# Altium schematic sheet SIM808.SchDoc
size A4
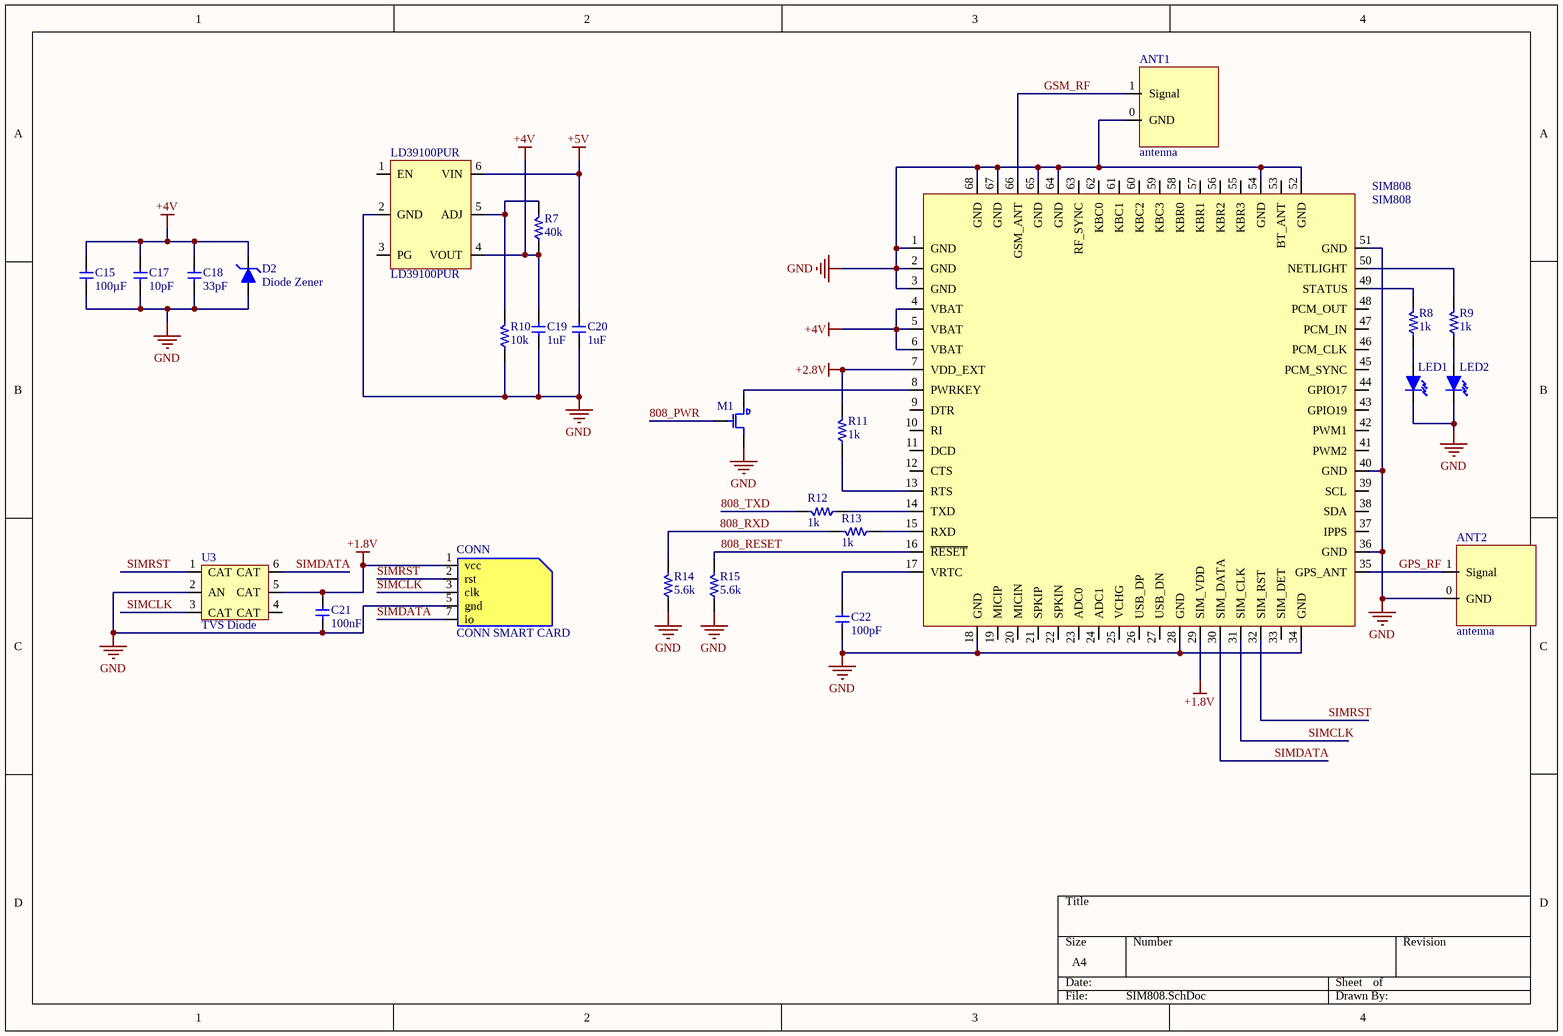
[diagram p0: SIM808.SchDoc]

## Parts
ANT1  antenna  [uFL]
ANT2  antenna  [uFL]
C15  Capacitance: 100µF  [Cap 1210]  (hidden comment: Cap Cer 100uF)
C17  value 10pF  [0805]  (hidden comment: Generic Capacitor)
C18  value 33pF  [0805]  (hidden comment: Generic Capacitor)
C19  value 1uF  [0805]  (hidden comment: Generic Capacitor)
C20  value 1uF  [0805]  (hidden comment: Generic Capacitor)
C21  value 100nF  [0805]  (hidden comment: Generic Capacitor)
C22  value 100pF  [0805]  (hidden comment: Generic Capacitor)
CONN  CONN SMART CARD  [CONN SMART CARD]
D2  Diode Zener  [Diode Zener]
LD39100PUR  LD39100PUR  [LD39100PUR]
LED1  Led Red  [0805 LED]  (value not drawn)
LED2  Led Green  [0805 LED]  (value not drawn)
M1  N-CH Mosfet Switch  [SOT32-3]  (value not drawn)
R7  value 40k  [0805]  (hidden comment: Resistor)
R8  value 1k  [0805]  (hidden comment: Resistor)
R9  value 1k  [0805]  (hidden comment: Resistor)
R10  value 10k  [0805]  (hidden comment: Resistor)
R11  value 1k  [0805]  (hidden comment: Resistor)
R12  value 1k  [0805]  (hidden comment: Resistor)
R13  value 1k  [0805]  (hidden comment: Resistor)
R14  value 5.6k  [0805]  (hidden comment: Resistor)
R15  value 5.6k  [0805]  (hidden comment: Resistor)
SIM808  SIM808  [SIM808]
U3  TVS Diode  [SMF05CT2G]

## Nets
+1.8V: C21.1 CONN.1(vcc) SIM808.29(SIM_VDD) U3.5(CAT)
+2.8V: R11.2 SIM808.7(VDD_EXT)
+4V: C15.1 C17.1 C18.1 C19.2 D2.1 LD39100PUR.4(VOUT) R7.1 SIM808.4(VBAT) SIM808.5(VBAT) SIM808.6(VBAT)
+5V: C20.1 LD39100PUR.6(VIN)
GND: ANT1.0(GND) ANT2.0(GND) C15.2 C17.2 C18.2 C19.1 C20.2 C21.2 C22.2 CONN.5(gnd) D2.2 LD39100PUR.2(GND) LED1.1 LED2.1 M1.2(S) R10.1 R14.1 R15.1 SIM808.1(GND) SIM808.2(GND) SIM808.3(GND) SIM808.18(GND) SIM808.28(GND) SIM808.34(GND) SIM808.36(GND) SIM808.40(GND) SIM808.51(GND) SIM808.52(GND) SIM808.54(GND) SIM808.64(GND) SIM808.65(GND) SIM808.67(GND) SIM808.68(GND) U3.2(AN)
808_PWR: M1.1(G)
808_RESET: R15.2 SIM808.16(~{RESET})
808_RXD: R13.2 R14.2
808_TXD: R12.2
GPS_RF: ANT2.1(Signal) SIM808.35(GPS_ANT)
GSM_RF: ANT1.1(Signal) SIM808.66(GSM_ANT)
SIMCLK: CONN.3(clk) SIM808.31(SIM_CLK) U3.3(CAT)
SIMDATA: CONN.7(io) SIM808.30(SIM_DATA) U3.6(CAT)
SIMRST: CONN.2(rst) SIM808.32(SIM_RST) U3.1(CAT)
NetC22_1: C22.1 SIM808.17(VRTC)
NetLD39100PUR_5: LD39100PUR.5(ADJ) R7.2 R10.2
NetLED1_2: LED1.2 R8.1
NetLED2_2: LED2.2 R9.1
NetM1_3: M1.3(D) SIM808.8(PWRKEY)
NetR8_2: R8.2 SIM808.49(STATUS)
NetR9_2: R9.2 SIM808.50(NETLIGHT)
NetR11_1: R11.1 SIM808.13(RTS)
NetR12_1: R12.1 SIM808.14(TXD)
NetR13_1: R13.1 SIM808.15(RXD)

Not connected (* = marked no-connect by the designer): LD39100PUR 1(EN) 3(PG); SIM808 9(DTR) 10(RI) 11(DCD) 12(CTS) 19(MICIP) 20(MICIN) 21(SPKIP) 22(SPKIN) 23(ADC0) 24(ADC1) 25(VCHG) 26(USB_DP) 27(USB_DN) 33(SIM_DET) 37(IPPS) 38(SDA) 39(SCL) 41(PWM2) 42(PWM1) 43(GPIO19) 44(GPIO17) 45(PCM_SYNC) 46(PCM_CLK) 47(PCM_IN) 48(PCM_OUT) 53(BT_ANT) 55(KBR3) 56(KBR2) 57(KBR1) 58(KBR0) 59(KBC3) 60(KBC2) 61(KBC1) 62(KBC0) 63(RF_SYNC); U3 4(CAT)

## Library data of the parts
ANT1 ANT2 = antenna: uFL SMT Antenna Connector; mfr: adafruit; supplier: https://www.adafruit.com/product/1661
C15 = LMK325ABJ107MM-P: CAP CER 100UF 10V X5R 1210; Manufacturer: Taiyo Yuden; Tolerance: ±20%; Supplier 1: Digi-Key; Manufacturer Part Number: LMK325ABJ107MM-P; Pricing 1: 1=1.55, 10=1.231, 25=1.1284, 50=1.0668, 100=0.9231, 250=0.82052, 500=0.69746 (CAD); Packaging: Cut Tape (CT); Part Status: Active; Voltage - Rated: 10V; Temperature Coefficient: X5R; Operating Temperature: -55°C ~ 85°C; Features: -; Ratings: -; Applications: General Purpose; Mounting Type: Surface Mount, MLCC; Package / Case: 1210 (3225 Metric); Size / Dimension: 0.126" L x 0.098" W (3.20mm x 2.50mm); Height - Seated (Max): -; Thickness (Max): 0.110" (2.80mm); Lead Spacing: -; Lead Style: -; ComponentLink1URL: http://ds.yuden.co.jp/TYCOMPAS/ut/detail.do?productNo=LMK325ABJ107MM-P&fileName=LMK325ABJ107MM-P_SS&mode=specSheetDownload; ComponentLink1Description: http://ds.yuden.co.jp/TYCOMPAS/ut/detail.do?productNo=LMK325ABJ107MM-P&fileName=LMK325ABJ107MM-P_SS&mode=specSheetDownload; Supplier Part Number 1: 587-4317-1-ND
C17-C22 = Capacitor
CONN = CONN SMART CARD: Manufacturer: Wurth Electronics Inc; Manufacturer Part Number: 693022010811; Card Type: Micro SIM; Number of Positions: 8; Connector Type: Connector and Ejector; Insertion, Removal Method: Hinged Lid; Supplier 1: Digi-Key; Pricing 1: 1=2.6, 10=2.384, 50=2.2076, 100=2.0317, 500=1.76614 (CAD); Packaging: Cut Tape (CT); Part Status: Active; Ejector Side: -; Mounting Type: Surface Mount, Right Angle; Features: Shielded; Height Above Board: 0.077" (1.95mm); Mounting Feature: Normal, Standard - Top; Contact Finish: Gold; Contact Finish Thickness: -; ComponentLink1URL: http://katalog.we-online.de/em/datasheet/693022010811.pdf; ComponentLink1Description: http://katalog.we-online.de/em/datasheet/693022010811.pdf; Supplier Part Number 1: 732-5957-1-ND
D2 = MMSZ5231BT1G: DIODE ZENER 5.1V 500MW SOD123; Manufacturer: ON Semiconductor; Tolerance: ±5%; Impedance (Max) (Zzt): 17 Ohm; Current - Reverse Leakage @ Vr: 5µA @ 2V; Voltage - Forward (Vf) (Max) @ If: 900mV @ 10mA; Supplier 1: Digi-Key; Manufacturer Part Number: MMSZ5231BT1G; Pricing 1: 1=0.34, 10=0.282, 100=0.149, 500=0.09802, 1000=0.06666 (CAD); Packaging: Cut Tape (CT); Part Status: Active; Voltage - Zener (Nom) (Vz): 5.1V; Power - Max: 500mW; Operating Temperature: -55°C ~ 150°C; Mounting Type: Surface Mount; Package / Case: SOD-123; Supplier Device Package: SOD-123; ComponentLink1URL: http://www.onsemi.com/pub_link/Collateral/MMSZ5221BT1-D.PDF; ComponentLink1Description: http://www.onsemi.com/pub_link/Collateral/MMSZ5221BT1-D.PDF; Supplier Part Number 1: MMSZ5231BT1GOSCT-ND
LD39100PUR = LD39100PUR: Adjustable linear voltage regulator; mfr: ST; supplier: http://www.digikey.ca/product-detail/en/stmicroelectronics/LD39100PUR/497-11013-1-ND/2524221
LED1 = LTST-C171EKT: LED RED CLEAR 0805 SMD; Manufacturer: Lite-On Inc.; Lens Color: Colorless; Millicandela Rating: 6mcd; Lens Style/Size: Rectangle with Flat Top, 1.40mm x 1.25mm; Voltage - Forward (Vf) (Typ): 2V; Current - Test: 20mA; Viewing Angle: 130°; Wavelength - Dominant: 621nm; Wavelength - Peak: 630nm; Supplier 1: Digi-Key; Manufacturer Part Number: LTST-C171EKT; Pricing 1: 1=0.48, 10=0.351, 25=0.2588, 100=0.1848, 250=0.12564, 500=0.11086, 1000=0.08684 (CAD); Packaging: Cut Tape (CT); Part Status: Active; Color: Red; Lens Transparency: Clear; Mounting Type: Surface Mount; Features: -; Package / Case: 0805 (2012 Metric); Supplier Device Package: Chip LED; Size / Dimension: 2.00mm L x 1.25mm W; Height (Max): 0.80mm; ComponentLink1URL: http://media.digikey.com/pdf/Data%20Sheets/Lite-On%20PDFs/LTST-C171EKT.pdf; ComponentLink1Description: http://media.digikey.com/pdf/Data%20Sheets/Lite-On%20PDFs/LTST-C171EKT.pdf; Supplier Part Number 1: 160-1422-1-ND
LED2 = LTST-C170GKT: LED GREEN CLEAR 0805 SMD; Manufacturer: Lite-On Inc.; Lens Color: Colorless; Millicandela Rating: 6mcd; Lens Style/Size: Rectangle with Flat Top, 1.40mm x 1.25mm; Voltage - Forward (Vf) (Typ): 2.1V; Current - Test: 10mA; Viewing Angle: 130°; Wavelength - Dominant: 569nm; Wavelength - Peak: 565nm; Supplier 1: Digi-Key; Manufacturer Part Number: LTST-C170GKT; Pricing 1: 1=0.48, 10=0.351, 25=0.2588, 100=0.1848, 250=0.12564, 500=0.11086, 1000=0.08684 (CAD); Packaging: Cut Tape (CT); Part Status: Active; Color: Green; Lens Transparency: Clear; Mounting Type: Surface Mount; Features: -; Package / Case: 0805 (2012 Metric); Supplier Device Package: -; Size / Dimension: 2.00mm L x 1.25mm W; Height (Max): 1.10mm; ComponentLink1URL: http://media.digikey.com/pdf/Data%20Sheets/Lite-On%20PDFs/LTST-C170GKT.pdf; ComponentLink1Description: http://media.digikey.com/pdf/Data%20Sheets/Lite-On%20PDFs/LTST-C170GKT.pdf; Supplier Part Number 1: 160-1179-1-ND
M1 = BSH105,215: MOSFET N-CH 20V 1.05A SOT23; Manufacturer: NXP USA Inc.; FET Type: N-Channel; Current - Continuous Drain (Id) @ 25°C: 1.05A (Ta); Drive Voltage (Max Rds On,  Min Rds On): 1.8V, 4.5V; Vgs(th) (Max) @ Id: 570mV @ 1mA; Gate Charge (Qg) (Max) @ Vgs: 3.9nC @ 4.5V; Input Capacitance (Ciss) (Max) @ Vds: 152pF @ 16V; Vgs (Max): ±8V; Power Dissipation (Max): 417mW (Ta); Rds On (Max) @ Id, Vgs: 200 mOhm @ 600mA, 4.5V; Supplier 1: Digi-Key; Manufacturer Part Number: BSH105,215; Pricing 1: 1=0.53, 10=0.425, 100=0.2902, 500=0.21758, 1000=0.16318 (CAD); Packaging: Cut Tape (CT); Part Status: Active; Technology: MOSFET (Metal Oxide); Drain to Source Voltage (Vdss): 20V; FET Feature: -; Operating Temperature: -55°C ~ 150°C (TJ); Mounting Type: Surface Mount; Supplier Device Package: TO-236AB (SOT23); Package / Case: TO-236-3, SC-59, SOT-23-3; ComponentLink1URL: http://www.nxp.com/documents/data_sheet/BSH105.pdf; ComponentLink1Description: http://www.nxp.com/documents/data_sheet/BSH105.pdf; Supplier Part Number 1: 568-6215-1-ND
R7-R15 = Resistor: Generic Resistor
SIM808 = SIM808: SIM808 GSM + GPRS + GPS Cellular Module; Mfr: SimCom; Supplier: http://www.ebay.ca/itm/291879777454?_trksid=p2057872.m2749.l2649&ssPageName=STRK%3AMEBIDX%3AIT
U3 = SMF05CT2G: TVS DIODE 5VWM 12.5VC SOT363; Manufacturer: ON Semiconductor; Unidirectional Channels: 5; Voltage - Reverse Standoff (Typ): 5V (Max); Voltage - Breakdown (Min): 6.2V; Voltage - Clamping (Max) @ Ipp: 12.5V; Current - Peak Pulse (10/1000µs): 8A (8/20µs); Power - Peak Pulse: 100W; Power Line Protection: No; Capacitance @ Frequency: 80pF @ 1MHz; Supplier 1: Digi-Key; Manufacturer Part Number: SMF05CT2G; Pricing 1: 1=0.53, 10=0.424, 100=0.2891, 500=0.21684, 1000=0.16262 (CAD); Packaging: Cut Tape (CT); Part Status: Active; Type: Zener; Bidirectional Channels: -; Applications: Automotive; Operating Temperature: -40°C ~ 125°C (TJ); Mounting Type: Surface Mount; Package / Case: 6-TSSOP, SC-88, SOT-363; Supplier Device Package: SC-88/SC70-6/SOT-363; ComponentLink1URL: http://www.onsemi.com/pub_link/Collateral/SMF05C-D.PDF; ComponentLink1Description: http://www.onsemi.com/pub_link/Collateral/SMF05C-D.PDF; Supplier Part Number 1: SMF05CT2GOSCT-ND